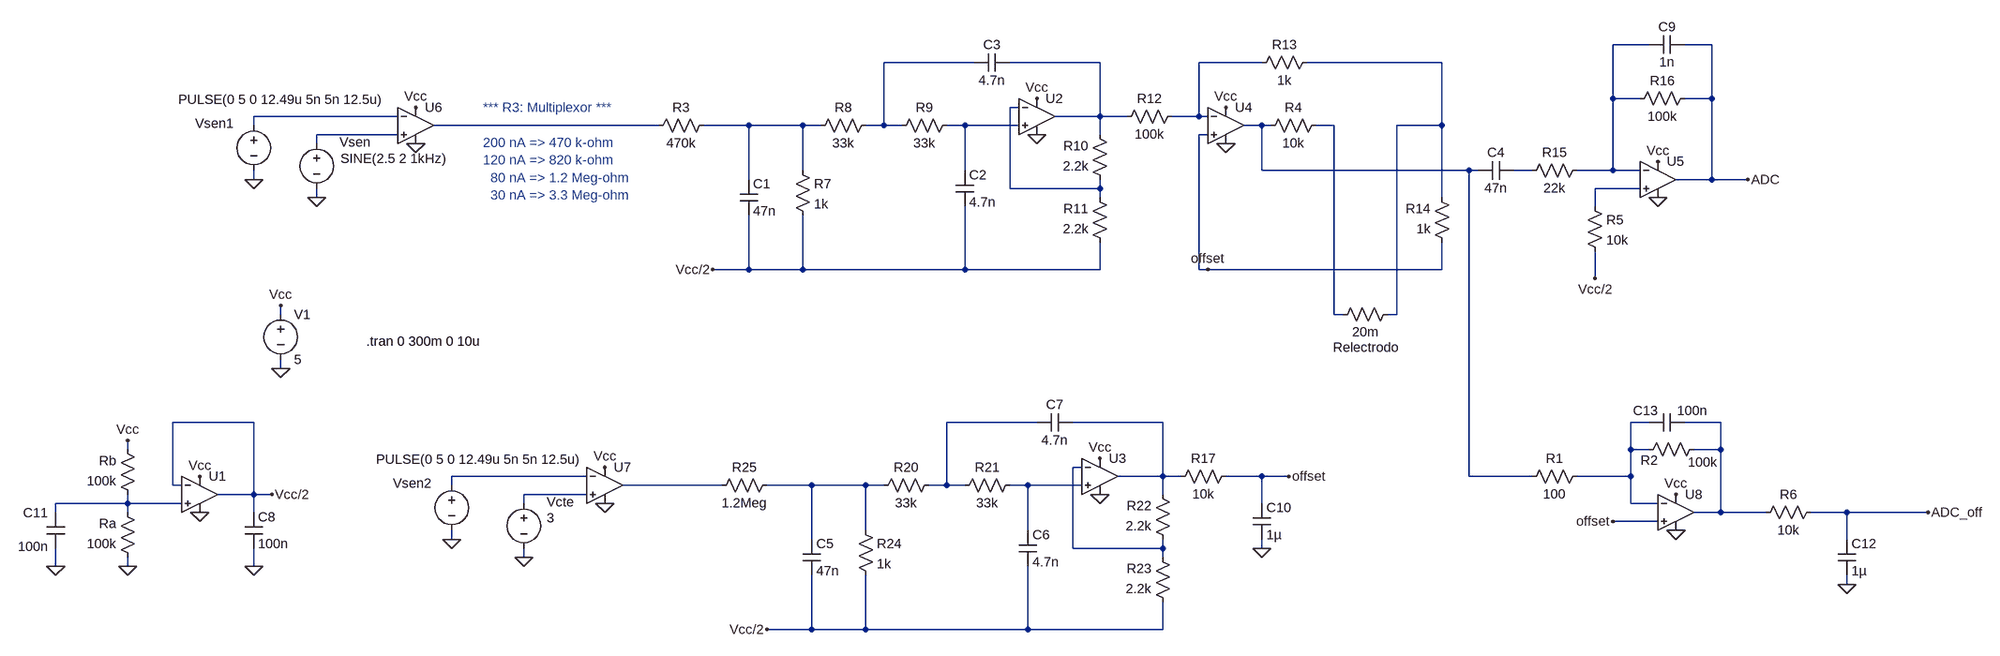
[diagram p0: schematic Esquemático.asc]
Esquemático.asc, the LTspice schematic file:
Version 4
SHEET 1 1452 1132
WIRE 688 32 624 32
WIRE 800 32 752 32
WIRE -512 64 -672 64
WIRE -288 64 -448 64
WIRE 0 64 -112 64
WIRE 320 64 80 64
WIRE 624 128 624 32
WIRE 672 128 624 128
WIRE 800 128 800 32
WIRE 800 128 752 128
WIRE -432 144 -448 144
WIRE -1536 160 -1792 160
WIRE -288 160 -288 64
WIRE -288 160 -368 160
WIRE -240 160 -288 160
WIRE -112 160 -112 64
WIRE -112 160 -160 160
WIRE -96 160 -112 160
WIRE -1792 176 -1792 160
WIRE -1072 176 -1472 176
WIRE -912 176 -992 176
WIRE -816 176 -912 176
WIRE -784 176 -816 176
WIRE -672 176 -672 64
WIRE -672 176 -704 176
WIRE -640 176 -672 176
WIRE -528 176 -560 176
WIRE -432 176 -528 176
WIRE 0 176 -32 176
WIRE 16 176 0 176
WIRE 128 176 96 176
WIRE 320 176 320 64
WIRE 320 176 240 176
WIRE -1536 192 -1680 192
WIRE -288 192 -288 160
WIRE -96 192 -112 192
WIRE -1680 208 -1680 192
WIRE -816 256 -816 176
WIRE -528 256 -528 176
WIRE 0 256 0 176
WIRE 368 256 0 256
WIRE 384 256 368 256
WIRE 480 256 448 256
WIRE 624 256 624 128
WIRE 624 256 560 256
WIRE 672 256 624 256
WIRE -1792 272 -1792 256
WIRE -912 272 -912 176
WIRE 800 272 800 128
WIRE 800 272 736 272
WIRE 864 272 800 272
WIRE -448 288 -448 144
WIRE -288 288 -288 272
WIRE -288 288 -448 288
WIRE 672 288 592 288
WIRE -1680 304 -1680 288
WIRE -288 304 -288 288
WIRE 320 304 320 176
WIRE 592 320 592 288
WIRE -912 432 -912 336
WIRE -912 432 -976 432
WIRE -816 432 -816 336
WIRE -816 432 -912 432
WIRE -528 432 -528 320
WIRE -528 432 -816 432
WIRE -288 432 -288 384
WIRE -288 432 -528 432
WIRE -112 432 -112 192
WIRE -96 432 -112 432
WIRE 320 432 320 384
WIRE 320 432 -96 432
WIRE 592 448 592 400
WIRE -1744 512 -1744 496
WIRE 128 512 128 176
WIRE 144 512 128 512
WIRE 240 512 240 176
WIRE 240 512 224 512
WIRE -1744 608 -1744 592
WIRE -1792 704 -1936 704
WIRE -400 704 -560 704
WIRE -176 704 -336 704
WIRE 688 704 656 704
WIRE 816 704 752 704
WIRE -2016 752 -2016 736
WIRE 656 752 656 704
WIRE 688 752 656 752
WIRE 816 752 816 704
WIRE 816 752 768 752
WIRE -320 784 -336 784
WIRE -1200 800 -1440 800
WIRE -176 800 -176 704
WIRE -176 800 -256 800
WIRE -144 800 -176 800
WIRE 0 800 -64 800
WIRE 48 800 0 800
WIRE 368 800 368 256
WIRE 480 800 368 800
WIRE 656 800 656 752
WIRE 656 800 560 800
WIRE -1936 816 -1936 704
WIRE -1920 816 -1936 816
WIRE -1440 816 -1440 800
WIRE -960 816 -1136 816
WIRE -800 816 -880 816
WIRE -704 816 -800 816
WIRE -672 816 -704 816
WIRE -560 816 -560 704
WIRE -560 816 -592 816
WIRE -528 816 -560 816
WIRE -416 816 -448 816
WIRE -320 816 -416 816
WIRE -1792 832 -1792 704
WIRE -1792 832 -1856 832
WIRE -1760 832 -1792 832
WIRE -1200 832 -1312 832
WIRE -176 832 -176 800
WIRE -2016 848 -2016 832
WIRE -2016 848 -2144 848
WIRE -1920 848 -2016 848
WIRE -1312 848 -1312 832
WIRE 0 848 0 800
WIRE 656 848 656 800
WIRE 704 848 656 848
WIRE -2144 864 -2144 848
WIRE -2016 864 -2016 848
WIRE -1792 864 -1792 832
WIRE 816 864 816 752
WIRE 816 864 768 864
WIRE 896 864 816 864
WIRE 1040 864 976 864
WIRE 1184 864 1040 864
WIRE 704 880 624 880
WIRE -704 896 -704 816
WIRE -416 896 -416 816
WIRE -1440 912 -1440 896
WIRE -800 912 -800 816
WIRE 1040 912 1040 864
WIRE -336 928 -336 784
WIRE -176 928 -176 912
WIRE -176 928 -336 928
WIRE 0 928 0 912
WIRE -1312 944 -1312 928
WIRE -176 944 -176 928
WIRE -2144 960 -2144 928
WIRE -2016 960 -2016 944
WIRE -1792 960 -1792 928
WIRE 1040 992 1040 976
WIRE -800 1072 -800 976
WIRE -800 1072 -880 1072
WIRE -704 1072 -704 976
WIRE -704 1072 -800 1072
WIRE -416 1072 -416 960
WIRE -416 1072 -704 1072
WIRE -176 1072 -176 1024
WIRE -176 1072 -416 1072
FLAG -1744 496 Vcc
FLAG -1744 608 0
FLAG 704 304 0
FLAG -64 208 0
FLAG -64 144 Vcc
FLAG 704 240 Vcc
FLAG -1680 304 0
FLAG -400 192 0
FLAG -400 128 Vcc
FLAG -2016 736 Vcc
FLAG -2016 960 0
FLAG -1888 800 Vcc
FLAG -1888 864 0
FLAG -1760 832 Vcc/2
FLAG 864 272 ADC
FLAG -1312 944 0
FLAG -288 832 0
FLAG -288 768 Vcc
FLAG -880 1072 Vcc/2
FLAG -976 432 Vcc/2
FLAG 48 800 offset
FLAG -1504 208 0
FLAG -1504 144 Vcc
FLAG -1792 272 0
FLAG -1168 848 0
FLAG -1168 784 Vcc
FLAG -1440 912 0
FLAG -1792 960 0
FLAG 736 896 0
FLAG 736 832 Vcc
FLAG -2144 960 0
FLAG 592 448 Vcc/2
FLAG 1184 864 ADC_off
FLAG 0 928 0
FLAG -96 432 offset
FLAG 624 880 offset
FLAG 1040 992 0
SYMBOL Opamps\\UniversalOpamp2 -64 176 R0
SYMATTR InstName U4
SYMATTR Value2 Avol=1Meg GBW=80Meg Slew=10Meg
SYMATTR SpiceLine ilimit=25m rail=0 Vos=-20u phimargin=45
SYMBOL res -256 176 R270
WINDOW 0 32 56 VTop 2
WINDOW 3 0 56 VBottom 2
SYMATTR InstName R12
SYMATTR Value 100k
SYMBOL res -16 80 R270
WINDOW 0 32 56 VTop 2
WINDOW 3 0 56 VBottom 2
SYMATTR InstName R13
SYMATTR Value 1k
SYMBOL res 336 400 R180
WINDOW 0 36 76 Left 2
WINDOW 3 36 40 Left 2
SYMATTR InstName R14
SYMATTR Value 1k
SYMBOL res 128 528 R270
WINDOW 0 -58 57 VTop 2
WINDOW 3 0 56 VBottom 2
SYMATTR InstName Relectrodo
SYMATTR Value 20m
SYMBOL voltage -1744 496 R0
SYMATTR InstName V1
SYMATTR Value 5
SYMBOL Opamps\\UniversalOpamp2 704 272 R0
SYMATTR InstName U5
SYMATTR Value2 Avol=1Meg GBW=80Meg Slew=10Meg
SYMATTR SpiceLine ilimit=25m rail=0 Vos=20u phimargin=45
SYMBOL res -48 784 R90
WINDOW 0 0 56 VBottom 2
WINDOW 3 32 56 VTop 2
SYMATTR InstName R17
SYMATTR Value 10k
SYMBOL res 464 272 R270
WINDOW 0 32 56 VTop 2
WINDOW 3 0 56 VBottom 2
SYMATTR InstName R15
SYMATTR Value 22k
SYMBOL cap 384 272 R270
WINDOW 0 32 32 VTop 2
WINDOW 3 0 32 VBottom 2
SYMATTR InstName C4
SYMATTR Value 47n
SYMBOL voltage -1680 192 R0
WINDOW 0 41 14 Left 2
WINDOW 3 42 43 Left 2
WINDOW 123 0 0 Left 2
WINDOW 39 0 0 Left 2
SYMATTR InstName Vsen
SYMATTR Value SINE(2.5 2 1kHz)
SYMBOL res -688 160 R90
WINDOW 0 0 56 VBottom 2
WINDOW 3 32 56 VTop 2
SYMATTR InstName R8
SYMATTR Value 33k
SYMBOL res -544 160 R90
WINDOW 0 0 56 VBottom 2
WINDOW 3 32 56 VTop 2
SYMATTR InstName R9
SYMATTR Value 33k
SYMBOL res -272 288 R180
WINDOW 0 36 76 Left 2
WINDOW 3 36 40 Left 2
SYMATTR InstName R10
SYMATTR Value 2.2k
SYMBOL res -272 400 R180
WINDOW 0 36 76 Left 2
WINDOW 3 36 40 Left 2
SYMATTR InstName R11
SYMATTR Value 2.2k
SYMBOL Opamps\\UniversalOpamp2 -400 160 R0
SYMATTR InstName U2
SYMATTR Value2 Avol=1Meg GBW=80Meg Slew=10Meg
SYMATTR SpiceLine ilimit=25m rail=0 Vos=20u phimargin=45
SYMBOL cap -544 256 R0
SYMATTR InstName C2
SYMATTR Value 4.7n
SYMBOL cap -512 80 R270
WINDOW 0 32 32 VTop 2
WINDOW 3 0 32 VBottom 2
SYMATTR InstName C3
SYMATTR Value 4.7n
SYMBOL res -832 240 R0
SYMATTR InstName R7
SYMATTR Value 1k
SYMBOL res -2000 960 R180
WINDOW 0 36 76 Left 2
WINDOW 3 36 40 Left 2
SYMATTR InstName Ra
SYMATTR Value 100k
SYMBOL res -2000 848 R180
WINDOW 0 36 76 Left 2
WINDOW 3 36 40 Left 2
SYMATTR InstName Rb
SYMATTR Value 100k
SYMBOL Opamps\\UniversalOpamp2 -1888 832 R0
SYMATTR InstName U1
SYMATTR Value2 Avol=1Meg GBW=80Meg Slew=10Meg
SYMATTR SpiceLine ilimit=25m rail=0 Vos=20u phimargin=45
SYMBOL res 768 112 R90
WINDOW 0 0 56 VBottom 2
WINDOW 3 32 56 VTop 2
SYMATTR InstName R16
SYMATTR Value 100k
SYMBOL voltage -1312 832 R0
WINDOW 0 41 14 Left 2
WINDOW 3 41 42 Left 2
WINDOW 123 0 0 Left 2
WINDOW 39 0 0 Left 2
SYMATTR InstName Vcte
SYMATTR Value 3
SYMBOL res -576 800 R90
WINDOW 0 0 56 VBottom 2
WINDOW 3 32 56 VTop 2
SYMATTR InstName R20
SYMATTR Value 33k
SYMBOL res -432 800 R90
WINDOW 0 0 56 VBottom 2
WINDOW 3 32 56 VTop 2
SYMATTR InstName R21
SYMATTR Value 33k
SYMBOL res -160 928 R180
WINDOW 0 36 76 Left 2
WINDOW 3 36 40 Left 2
SYMATTR InstName R22
SYMATTR Value 2.2k
SYMBOL res -160 1040 R180
WINDOW 0 36 76 Left 2
WINDOW 3 36 40 Left 2
SYMATTR InstName R23
SYMATTR Value 2.2k
SYMBOL Opamps\\UniversalOpamp2 -288 800 R0
SYMATTR InstName U3
SYMATTR Value2 Avol=1Meg GBW=80Meg Slew=10Meg
SYMATTR SpiceLine ilimit=25m rail=0 Vos=20u phimargin=45
SYMBOL cap -432 896 R0
SYMATTR InstName C6
SYMATTR Value 4.7n
SYMBOL cap -400 720 R270
WINDOW 0 32 32 VTop 2
WINDOW 3 0 32 VBottom 2
SYMATTR InstName C7
SYMATTR Value 4.7n
SYMBOL res -720 880 R0
SYMATTR InstName R24
SYMATTR Value 1k
SYMBOL res -864 800 R90
WINDOW 0 0 56 VBottom 2
WINDOW 3 32 56 VTop 2
SYMATTR InstName R25
SYMATTR Value 1.2Meg
SYMBOL res -976 160 R90
WINDOW 0 0 56 VBottom 2
WINDOW 3 32 56 VTop 2
SYMATTR InstName R3
SYMATTR Value 470k
SYMBOL Opamps\\UniversalOpamp2 -1504 176 R0
SYMATTR InstName U6
SYMATTR Value2 Avol=1Meg GBW=80Meg Slew=10Meg
SYMATTR SpiceLine ilimit=25m rail=0 Vos=20u phimargin=45
SYMBOL voltage -1792 160 R0
WINDOW 0 -104 12 Left 2
WINDOW 3 -134 -30 Left 2
WINDOW 123 0 0 Left 2
WINDOW 39 0 0 Left 2
SYMATTR InstName Vsen1
SYMATTR Value PULSE(0 5 0 12.49u 5n 5n 12.5u)
SYMBOL Opamps\\UniversalOpamp2 -1168 816 R0
SYMATTR InstName U7
SYMATTR Value2 Avol=1Meg GBW=80Meg Slew=10Meg
SYMATTR SpiceLine ilimit=25m rail=0 Vos=20u phimargin=45
SYMBOL voltage -1440 800 R0
WINDOW 0 -104 12 Left 2
WINDOW 3 -134 -30 Left 2
WINDOW 123 0 0 Left 2
WINDOW 39 0 0 Left 2
SYMATTR InstName Vsen2
SYMATTR Value PULSE(0 5 0 12.49u 5n 5n 12.5u)
SYMBOL cap -928 272 R0
SYMATTR InstName C1
SYMATTR Value 47n
SYMBOL cap -816 912 R0
SYMATTR InstName C5
SYMATTR Value 47n
SYMBOL cap -1808 864 R0
SYMATTR InstName C8
SYMATTR Value 100n
SYMBOL cap 688 48 R270
WINDOW 0 32 32 VTop 2
WINDOW 3 0 32 VBottom 2
SYMATTR InstName C9
SYMATTR Value 1n
SYMBOL Opamps\\UniversalOpamp2 736 864 R0
SYMATTR InstName U8
SYMATTR Value2 Avol=1Meg GBW=80Meg Slew=10Meg
SYMATTR SpiceLine ilimit=25m rail=0 Vos=20u phimargin=45
SYMBOL cap -2160 864 R0
WINDOW 0 -42 1 Left 2
WINDOW 3 -51 61 Left 2
SYMATTR InstName C11
SYMATTR Value 100n
SYMBOL res 464 816 R270
WINDOW 0 32 56 VTop 2
WINDOW 3 0 56 VBottom 2
SYMATTR InstName R1
SYMATTR Value 100
SYMBOL res 672 768 R270
WINDOW 0 -19 17 VTop 2
WINDOW 3 9 112 VBottom 2
SYMATTR InstName R2
SYMATTR Value 100k
SYMBOL cap 688 720 R270
WINDOW 0 21 -6 VTop 2
WINDOW 3 52 77 VBottom 2
SYMATTR InstName C13
SYMATTR Value 100n
SYMBOL cap -16 848 R0
SYMATTR InstName C10
SYMATTR Value 1µ
SYMBOL res 0 192 R270
WINDOW 0 32 56 VTop 2
WINDOW 3 0 56 VBottom 2
SYMATTR InstName R4
SYMATTR Value 10k
SYMBOL res 576 304 R0
SYMATTR InstName R5
SYMATTR Value 10k
SYMBOL res 992 848 R90
WINDOW 0 0 56 VBottom 2
WINDOW 3 32 56 VTop 2
SYMATTR InstName R6
SYMATTR Value 10k
SYMBOL cap 1024 912 R0
SYMATTR InstName C12
SYMATTR Value 1µ
TEXT -1592 560 Left 2 !.tran 0 300m 0 10u
TEXT -1384 144 Left 2 ;*** R3: Multiplexor ***\n \n200 nA => 470 k-ohm\n120 nA => 820 k-ohm\n  80 nA => 1.2 Meg-ohm\n  30 nA => 3.3 Meg-ohm

The netlist it stands for:
* Esquemático.asc
XU4 offset N004 Vcc 0 N011 level.2 Avol=1Meg GBW=80Meg Slew=10Meg ilimit=25m rail=0 Vos=-20u phimargin=45 en=0 enk=0 in=0 ink=0 Rin=500Meg  ; pins IN+ IN- V+ V- OUT
R12 N003 N004 100k
R13 N004 N005 1k
R14 offset N005 1k
Relectrodo N012 N005 20m
V1 Vcc 0 5
XU5 N015 N001 Vcc 0 ADC level.2 Avol=1Meg GBW=80Meg Slew=10Meg ilimit=25m rail=0 Vos=20u phimargin=45 en=0 enk=0 in=0 ink=0 Rin=500Meg  ; pins IN+ IN- V+ V- OUT
R17 offset N017 10k
R15 N014 N001 22k
C4 N011 N014 47n
Vsen N013 0 SINE(2.5 2 1kHz)
R8 N002 N009 33k
R9 N010 N002 33k
R10 N006 N003 2.2k
R11 Vcc/2 N006 2.2k
XU2 N010 N006 Vcc 0 N003 level.2 Avol=1Meg GBW=80Meg Slew=10Meg ilimit=25m rail=0 Vos=20u phimargin=45 en=0 enk=0 in=0 ink=0 Rin=500Meg  ; pins IN+ IN- V+ V- OUT
C2 N010 Vcc/2 4.7n
C3 N002 N003 4.7n
R7 N009 Vcc/2 1k
Ra 0 N026 100k
Rb N026 Vcc 100k
XU1 N026 Vcc/2 Vcc 0 Vcc/2 level.2 Avol=1Meg GBW=80Meg Slew=10Meg ilimit=25m rail=0 Vos=20u phimargin=45 en=0 enk=0 in=0 ink=0 Rin=500Meg  ; pins IN+ IN- V+ V- OUT
R16 ADC N001 100k
Vcte N025 0 3
R20 N016 N023 33k
R21 N024 N016 33k
R22 N020 N017 2.2k
R23 Vcc/2 N020 2.2k
XU3 N024 N020 Vcc 0 N017 level.2 Avol=1Meg GBW=80Meg Slew=10Meg ilimit=25m rail=0 Vos=20u phimargin=45 en=0 enk=0 in=0 ink=0 Rin=500Meg  ; pins IN+ IN- V+ V- OUT
C6 N024 Vcc/2 4.7n
C7 N016 N017 4.7n
R24 N023 Vcc/2 1k
R25 N023 N022 1.2Meg
R3 N009 N008 470k
XU6 N013 N007 Vcc 0 N008 level.2 Avol=1Meg GBW=80Meg Slew=10Meg ilimit=25m rail=0 Vos=20u phimargin=45 en=0 enk=0 in=0 ink=0 Rin=500Meg  ; pins IN+ IN- V+ V- OUT
Vsen1 N007 0 PULSE(0 5 0 12.49u 5n 5n 12.5u)
XU7 N025 N021 Vcc 0 N022 level.2 Avol=1Meg GBW=80Meg Slew=10Meg ilimit=25m rail=0 Vos=20u phimargin=45 en=0 enk=0 in=0 ink=0 Rin=500Meg  ; pins IN+ IN- V+ V- OUT
Vsen2 N021 0 PULSE(0 5 0 12.49u 5n 5n 12.5u)
C1 N009 Vcc/2 47n
C5 N023 Vcc/2 47n
C8 Vcc/2 0 100n
C9 N001 ADC 1n
XU8 offset N018 Vcc 0 N019 level.2 Avol=1Meg GBW=80Meg Slew=10Meg ilimit=25m rail=0 Vos=20u phimargin=45 en=0 enk=0 in=0 ink=0 Rin=500Meg  ; pins IN+ IN- V+ V- OUT
C11 N026 0 100n
R1 N011 N018 100
R2 N018 N019 100k
C13 N018 N019 100n
C10 offset 0 1µ
R4 N011 N012 10k
R5 N015 Vcc/2 10k
R6 ADC_off N019 10k
C12 ADC_off 0 1µ
.tran 0 300m 0 10u
* *** R3: Multiplexor ***
* 200 nA => 470 k-ohm
* 120 nA => 820 k-ohm
*   80 nA => 1.2 Meg-ohm
*   30 nA => 3.3 Meg-ohm
.lib UniversalOpamps2.sub
.backanno
.end